# EAGLE design slowik12 (EAGLE 7.5.0)
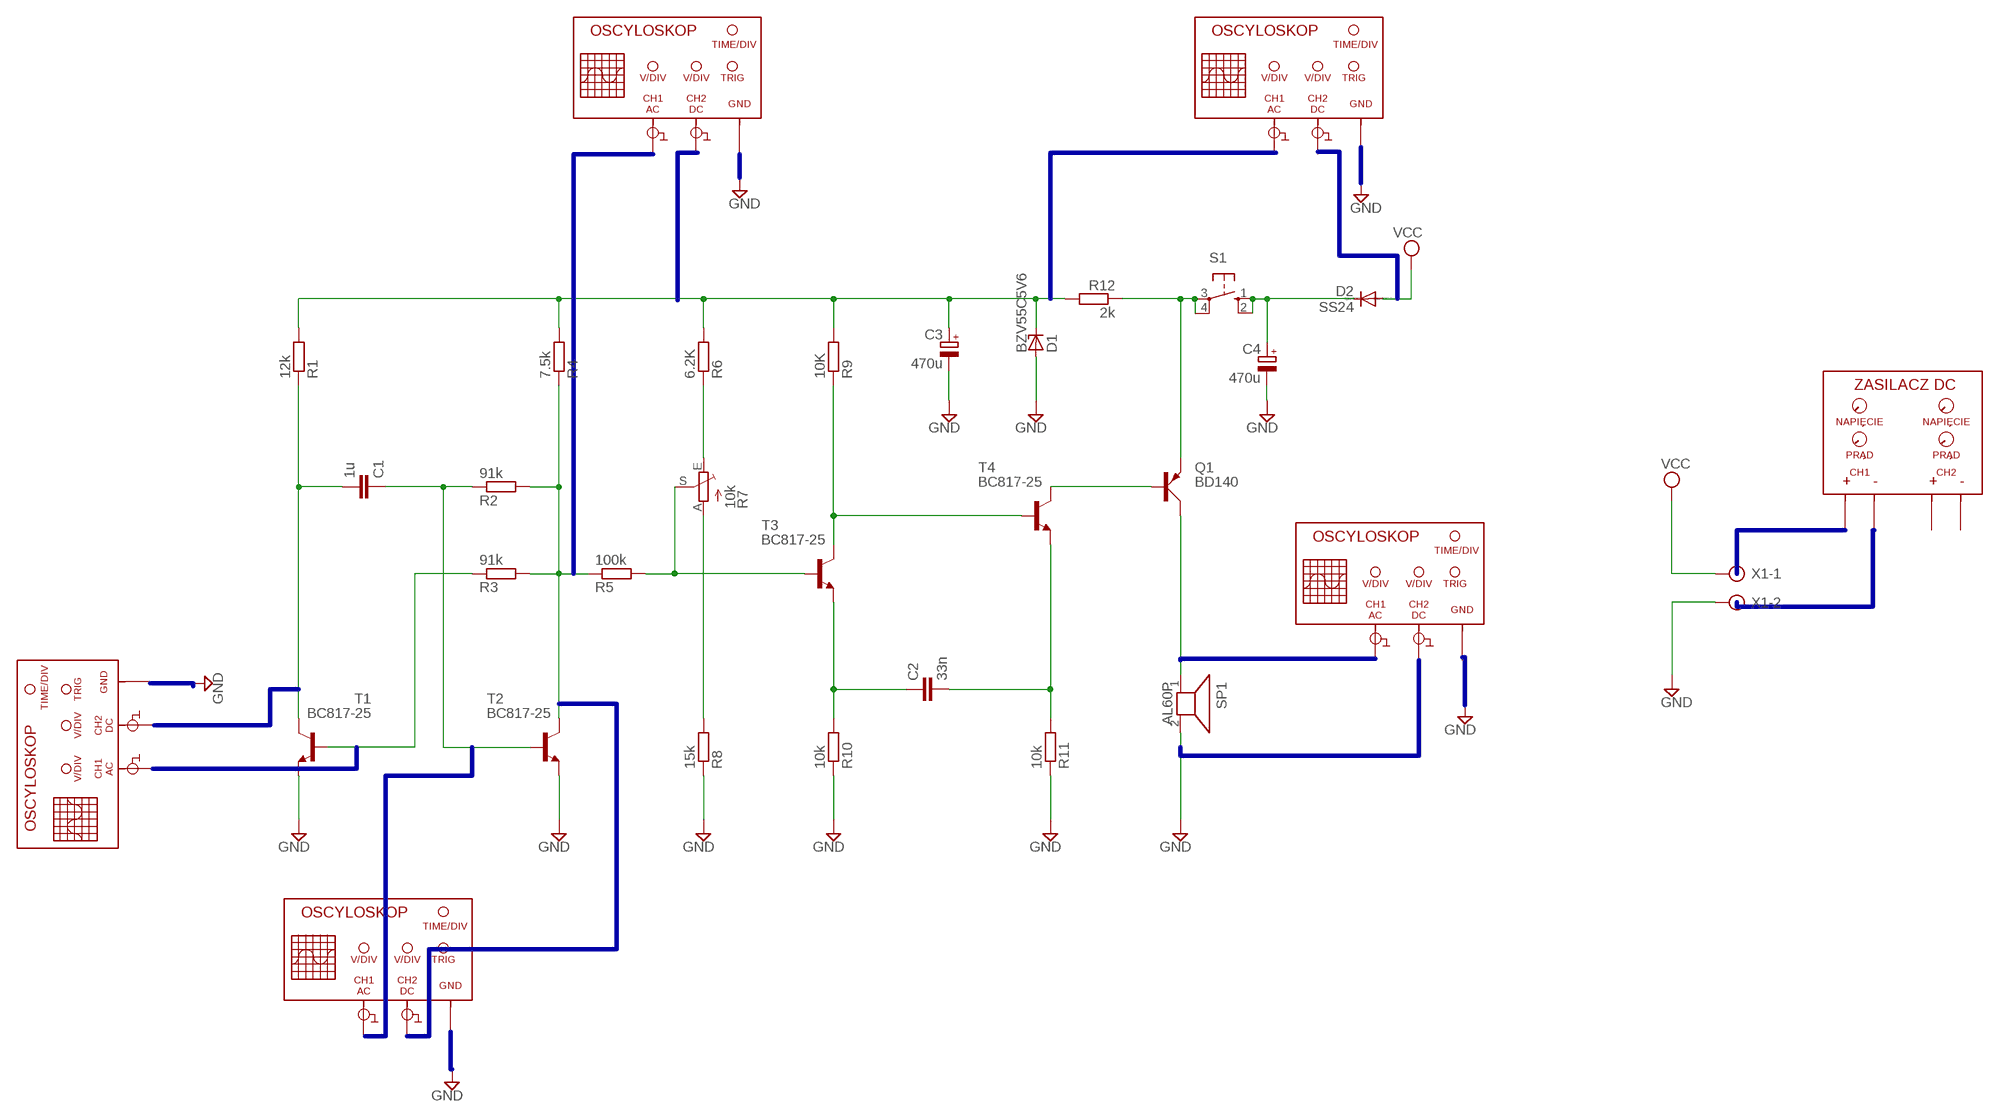
[diagram p0: schematic, sheet 1]

## Parts
C1  1u  C-EUC1206  [C1206]
C2  33n  C2.5/2  [C2.5-2]
C3  470u  CPOL-EUE3.5-8  [E3,5-8]
C4  470u  CPOL-EUE3.5-8  [E3,5-8]
D1  BZV55C5V6  ZENER-DIODESOD80C  [SOD80C]
D2  SS24  ES2D  [SMB]
Q1  BD140  [TO126AV]
R1  12k  R-EU_R1206  [R1206]
R2  91k  R-EU_R1206  [R1206]
R3  91k  R-EU_R1206  [R1206]
R4  7.5k  R-EU_R1206  [R1206]
R5  100k  R-EU_R1206  [R1206]
R6  6.2K  R-EU_R1206  [R1206]
R7  10k  TRIM_EU-PT10  [PT-10]
R8  15k  R-EU_R1206  [R1206]
R9  10K  R-EU_R1206  [R1206]
R10  10k  R-EU_R1206  [R1206]
R11  10k  R-EU_R1206  [R1206]
R12  2k  R-EU_R1206  [R1206]
S1  10-XX  [B3F-10XX]
SP1  AL60P  [AL60P]
T1  BC817-25  BC817-25-NPN-SOT23-BEC  [SOT23-BEC]
T2  BC817-25  BC817-25-NPN-SOT23-BEC  [SOT23-BEC]
T3  BC817-25  BC817-25-NPN-SOT23-BEC  [SOT23-BEC]
T4  BC817-25  BC817-25-NPN-SOT23-BEC  [SOT23-BEC]
U$1  OSCYLOSKOP_DC_DC  [OSCYLOSKOP]
U$2  OSCYLOSKOP_DC_DC  [OSCYLOSKOP]
U$3  ZASILACZ  [ZASILACZ]
U$4  OSCYLOSKOP_DC_DC  [OSCYLOSKOP]
U$5  OSCYLOSKOP_DC_DC  [OSCYLOSKOP]
U$6  OSCYLOSKOP_DC_DC  [OSCYLOSKOP]
X1  AK500/2  [AK500/2]

## Nets
GND: C3.- C4.- D1.A R8.1 R10.1 R11.1 SP1.2 T1.E T2.E X1.2
N$1: R6.1 R7.E
N$2: R7.A R8.2
N$3: Q1.E R12.1 S1.3(P) S1.4(P1)
N$4: Q1.C SP1.1
N$5: Q1.B T4.C
N$6: C2.2 R11.2 T4.E
N$7: C4.+ D2.C S1.1(S) S1.2(S1)
N$9: R9.1 T3.C T4.B
N$10: C2.1 R10.2 T3.E
N$11: C1.2 R1.1 T1.C
N$12: R2.2 R3.2 R4.1 R5.1 T2.C
N$13: C1.1 R2.1 T2.B
N$14: R3.1 T1.B
N$15: R5.2 R7.S T3.B
N$16: C3.+ D1.C R1.2 R4.2 R6.2 R9.2 R12.2
VCC: D2.A X1.1
Unconnected: U$1.CH1 U$1.CH2 U$1.GND U$2.CH1 U$2.CH2 U$2.GND U$3.C1+(CH1+) U$3.C1-(CH1-) U$3.C2+(CH2+) U$3.C2-(CH2-) U$4.CH1 U$4.CH2 U$4.GND U$5.CH1 U$5.CH2 U$5.GND U$6.CH1 U$6.CH2 U$6.GND

## Buses
B$1
B$2
B$3
B$4
B$6
B$7
B$8
B$9
B$11
B$12
B$5
B$10
B$13
B$14
B$15
B$16
B$17

## Library data of the parts
C1 = resistor:C-EU: CAPACITOR, European symbol
C2 = capacitor-wima:C: CAPACITOR naming: grid - package width
C3 C4 = rcl:CPOL-EU: POLARIZED CAPACITOR, European symbol
D1 = diode:ZENER-DIODE: Z-Diode
D2 = diode:ES2D: DIODE super fast rectifier, 2 A
Q1 = transistor-power:BD140: PNP TRANSISTOR
R1-R6 R8-R12 = resistor:R-EU_: RESISTOR, European symbol
R7 = pot:TRIM_EU-: POTENTIOMETER
S1 = switch-omron:10-XX: OMRON SWITCH; MPN: B3F-1000; OC_FARNELL: 176432; OC_NEWARK: 36M3542
SP1 = buzzer:AL60P: SPEAKER Source: Buerklin; OC_FARNELL: unknown; OC_NEWARK: unknown
T1-T4 = transistor-neu-to92:*-NPN-: NPN Transistror
U$1 U$2 U$4-U$6 = Przyrzady pomiarowe:OSCYLOSKOP_DC_DC
U$3 = Przyrzady pomiarowe:ZASILACZ
X1 = con-ptr500:AK500/2: CONNECTOR; OC_FARNELL: unknown; OC_NEWARK: unknown

## Board
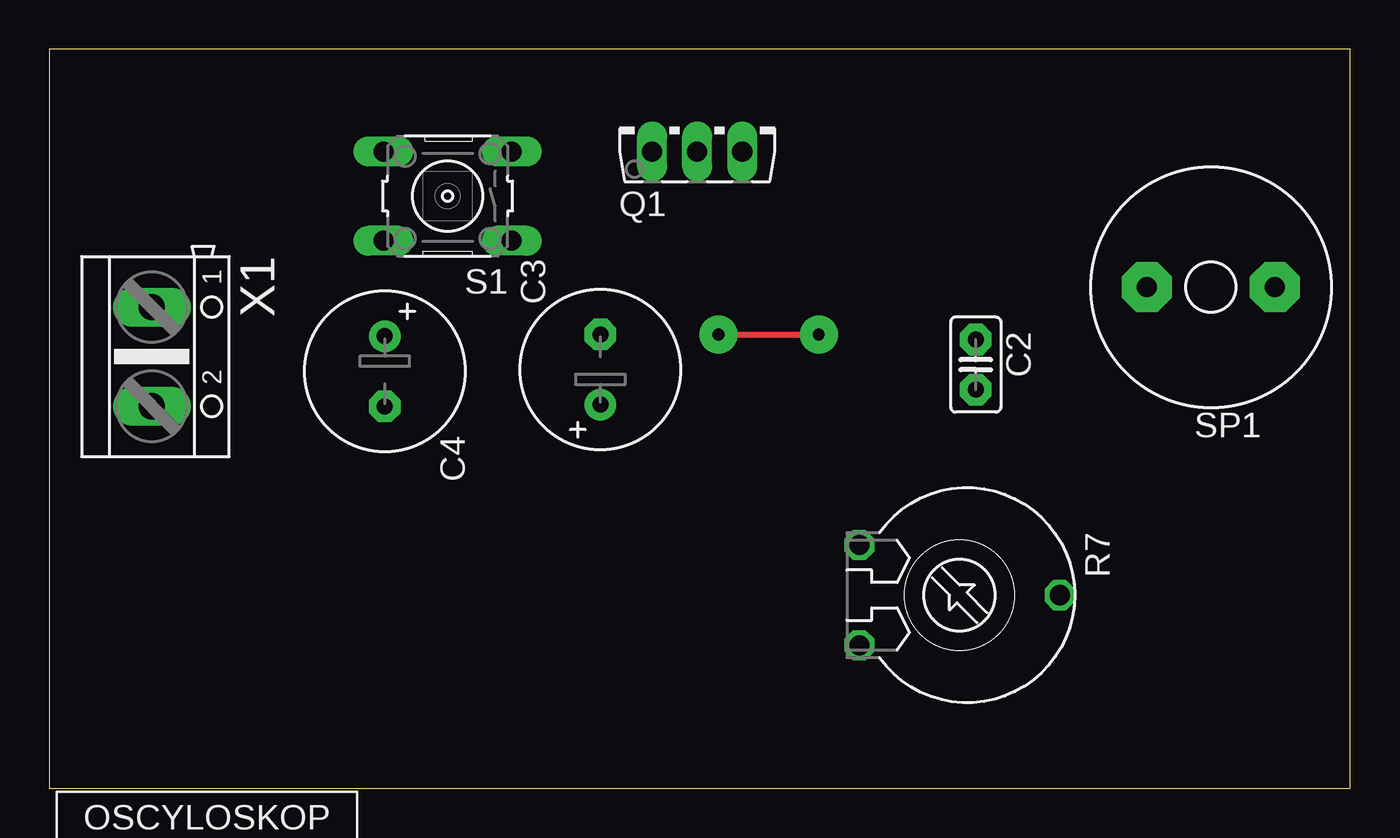
[diagram p1: board, top side]
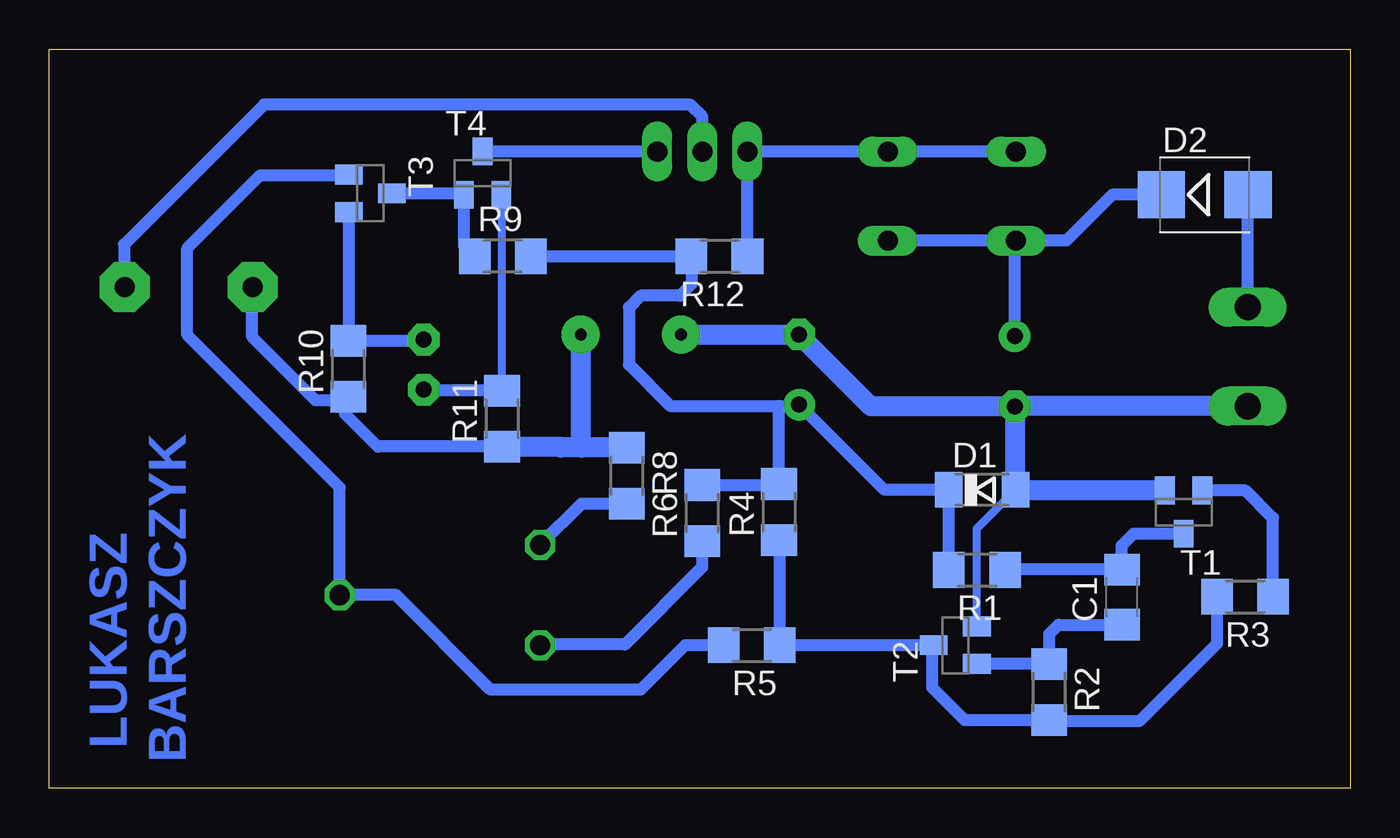
[diagram p2: board, bottom side, seen from below]

Size 66 x 37.5 mm. Coordinates in mm from the lower left corner, seen from the top.
Outline: 0,0 66,0 66,37.5 0,37.5 0,0
Copper layers (1*16): Top 0.035mm / dielectric 1.5mm / Bottom 0.035mm
Design rules "OpenLab": minimum track width 0.4mm, minimum drill 0.6mm, track to track 0.5mm, track to pad 0.5mm, pad to pad 0.5mm, via to via 0.5mm, smd to smd 0.1mm, copper to edge 2mm, drill to drill 0.2mm, minimum pad ring 10mil, minimum via ring 8mil, stop-mask expansion 4mil, vias tented up to drill 0mil, thermal gap 10mil

### Footprints (pad centres in the part's own frame; a part is rotated, then mirrored left to right if it is on the bottom)
C1206 = smd 1.6 x 1.8: 1 -1.4,0; 2 1.4,0
C2.5-2 = drill 0.813 pad 1.6 octagon: 1 -1.27,0; 2 1.27,0
E3,5-8 = drill 0.813 pad 1.6: + -1.778,0 | drill 0.813 pad 1.6 octagon: - 1.778,0
SOD80C = smd 1.4 x 1.8: A 1.7,0; C -1.7,0
SMB = smd 2.4 x 2.4: A 2.2,0; C -2.2,0
TO126AV = drill 1.016 long: B 2.286,-1.27; C 0,-1.27; E -2.286,-1.27
R1206 = smd 1.6 x 1.803: 1 -1.422,0; 2 1.422,0
PT-10 = drill 1.016 octagon: A -2.54,-5.08; E 2.54,-5.08; S 0,5.08
B3F-10XX = drill 1.016 long: 1 -3.251,2.261; 2 3.251,2.261; 3 -3.251,-2.261; 4 3.251,-2.261
AL60P = drill 1.016 pad 2.54 octagon: 1 -3.251,0; 2 3.251,0
SOT23-BEC = smd 1 x 1.4: B -0.95,-1.1; C 0,1.1; E 0.95,-1.1
OSCYLOSKOP = drill 0.8 offset: CH1 -5.08,-1.27; CH2 -1.27,-1.27; GND 3.81,-1.27
ZASILACZ = drill 0.8 offset: C1+ -5.08,-1.27; C1- -1.27,-1.27; C2+ 2.54,-1.27; C2- 6.35,-1.27
AK500/2 = drill 1.321 long: 1 -2.515,0; 2 2.515,0

### Placement (x,y rotation side)
C1  11.58,9.7 90 bottom
C2  47,21.5 270 top
C3  27.96,21.25 90 top
C4  17.02,21.16 270 top
D1  18.68,15.14 0 bottom
D2  7.38,30.12 0 bottom
Q1  32.87,33.58 0 top
R1  18.94,11.08 180 bottom
R2  15.27,4.88 270 bottom
R3  5.34,9.72 180 bottom
R4  28.98,14.02 90 bottom
R5  30.36,7.26 180 bottom
R6  32.88,13.97 90 bottom
R7  46.18,9.8 270 top
R8  36.7,15.86 270 bottom
R9  43,27 0 bottom
R10  50.83,21.28 90 bottom
R11  43.03,18.76 90 bottom
R12  32,27 180 bottom
S1  20.21,30.05 180 top
SP1  58.93,25.43 180 top
T1  8.45,14.01 180 bottom
T2  20.04,7.26 90 bottom
T3  49.71,30.19 270 bottom
T4  44.02,31.22 0 bottom
U$1  8,-4 0 top  (outside the outline)
U$2  8,-13 0 top  (outside the outline)
U$3  8,-22 0 top  (outside the outline)
U$4  8,-31 0 top  (outside the outline)
U$5  8,-40 0 top  (outside the outline)
U$6  8,-49 0 top  (outside the outline)
X1  5.2,21.9 270 top

### Tracks (layer width: path | path; a pad name or v marks a point on that pad's centre or on a via)
GND  (via drill 0.6 pad 1.93)
  Top 0.305: v33.96,23.02 v39.04,23.02
  Bottom 0.406: T2.E 18.94,13.18 D1.A 16.95,15.11
  Bottom 0.61: C3.- | 16.98,19.34 C4.- | 40.04,17.28 40.04,17.34 | 39.04,17.32 39,17.28 | R11.1 49.34,17.34 51,19 51,19.69 | 51,19.69 R10.1 | 51,19.69 52.49,19.69 55.7,22.9 55.7,25.41 SP1.2
  Bottom 1.016: R11.1 40.04,17.34 | C3.- 24.31,19.38 C4.- X1.2 | v33.96,23.02 C3.- | D1.A 16.98,19.34 | R8.1 39,17.28 40.04,17.28 | T1.E 16.95,15.11 | v39.04,23.02 39.04,17.32
N$1
  Bottom 0.61: R6.1 32.88,11.22 36.8,7.3 41.06,7.3 R7.E
N$2
  Bottom 0.61: R8.2 39,14.44 R7.A
N$3
  Bottom 0.61: S1.4 S1.3 Q1.E R12.1
N$4
  Bottom 0.61: Q1.C 32.87,34.07 33.5,34.7 55.1,34.7 62.2,27.6 62.2,25.45 SP1.1
N$5
  Bottom 0.61: T4.C Q1.B
N$6
  Bottom 0.406: R11.2 43.03,30.08 T4.E
  Bottom 0.61: R11.2 46.95,20.18 C2.2
N$7
  Bottom 0.61: S1.2 S1.1 | C4.+ 17.02,27.73 S1.2 | D2.C 12.08,30.12 14.4,27.8 16.95,27.8 S1.2
N$9
  Bottom 0.61: T3.C 45.04,30.19 T4.B 44.97,27.55 R9.1
N$10
  Bottom 0.61: T3.E 50.81,22.72 | 50.81,22.72 R10.2 | 50.81,22.72 47.05,22.72 C2.1
N$11
  Bottom 0.61: R1.1 17.5,11.1 C1.2 11.6,11.12 11.6,12.3 10.99,12.91 T1.C
N$12
  Bottom 0.61: R3.2 6.76,7.34 10.7,3.4 15.21,3.4 R2.2 19.56,3.46 21.2,5.1 21.2,7.2 T2.C R5.1 28.94,12.56 R4.1
N$13
  Bottom 0.61: 19,6.25 T2.B R2.1 15.27,7.83 14.8,8.3 C1.1
N$14
  Bottom 0.61: R3.1 3.92,13.72 5.3,15.1 T1.B
N$15
  Bottom 0.61: R5.2 33.74,7.26 36,5 43.6,5 48.4,9.8 R7.S 51.26,15.26 59,23 59,27.4 55.3,31.1 50.85,31.1 T3.B
N$16
  Bottom 0.61: R1.2 20.36,15.12 D1.C 23.63,15.14 C3.+ 28.03,19.4 29,19.4 | R6.2 29.03,15.39 R4.2 28.98,19.38 29,19.4 | R9.2 R12.2 33.42,25.58 34,25 36,25 36.6,24.4 36.6,21.5 34.5,19.4 29,19.4
VCC
  Bottom 0.61: X1.1 5.2,30.1 D2.A

### Text on the board
Bottom: BARSZCZYK | LUKASZ